# Altium schematic sheet PowerSup.SchDoc
size A3
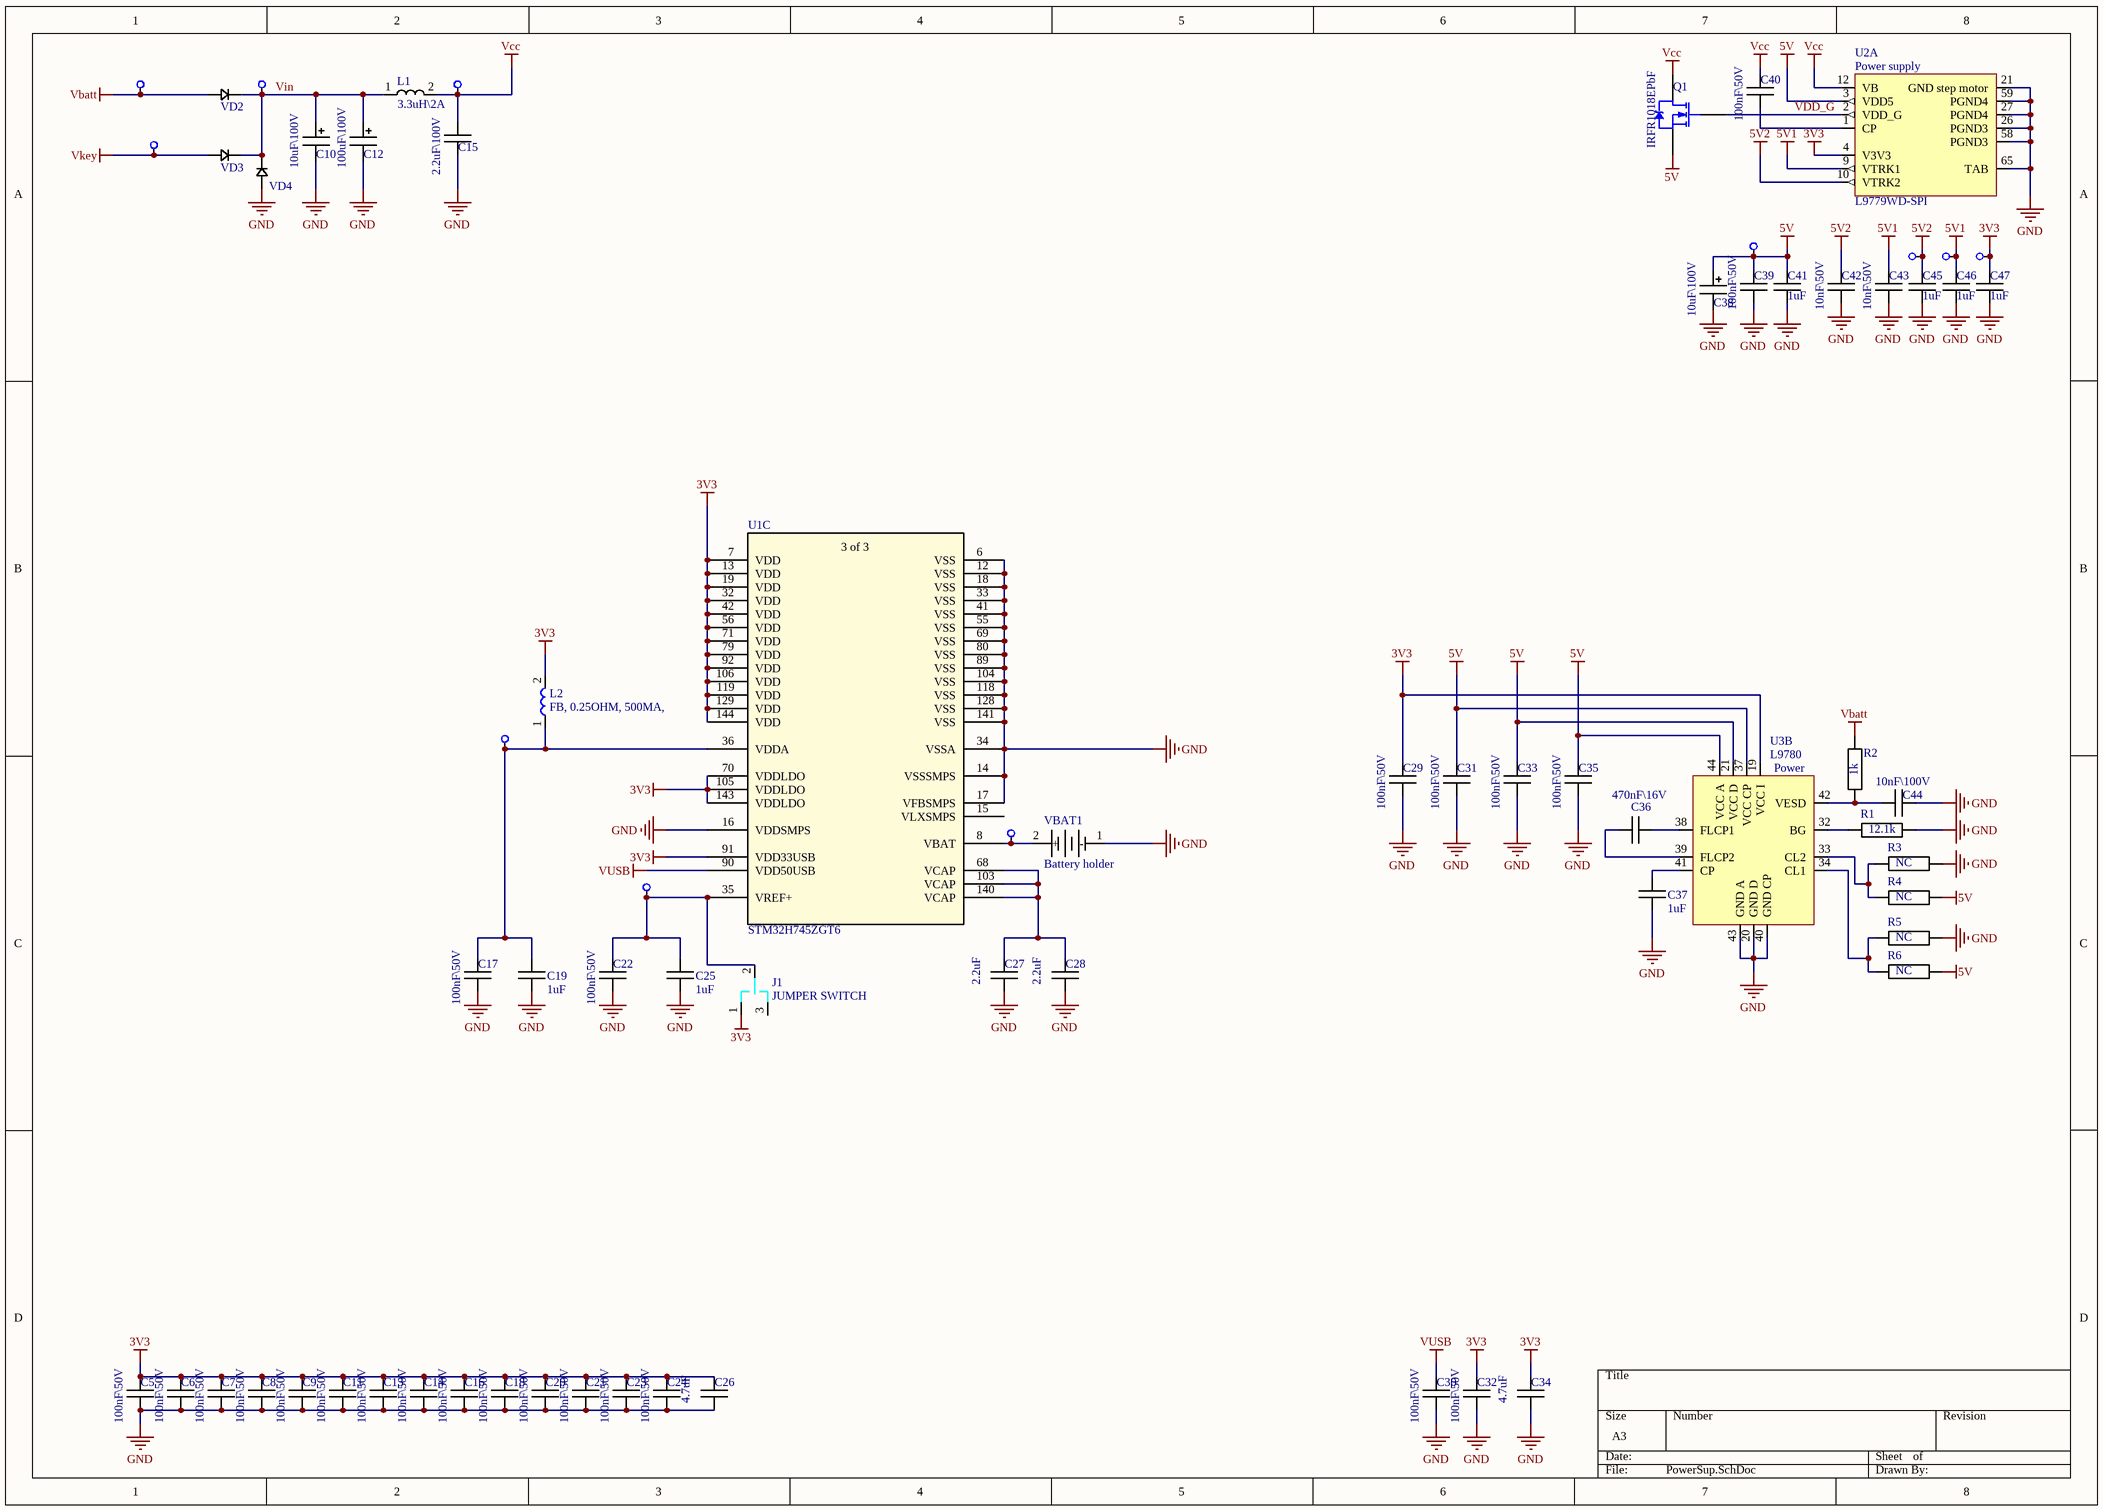
[diagram p0: PowerSup.SchDoc]

## Parts
C5  100nF\50V  [SMD 0603]
C6  100nF\50V  [SMD 0603]
C7  100nF\50V  [SMD 0603]
C8  100nF\50V  [SMD 0603]
C9  100nF\50V  [SMD 0603]
C10  10uF\100V  [CAP 5x11]
C11  100nF\50V  [SMD 0603]
C12  100uF\100V  [CAP 10x20]
C13  100nF\50V  [SMD 0603]
C14  100nF\50V  [SMD 0603]
C15  2.2uF\100V  [SMD 1206]
C16  100nF\50V  [SMD 0603]
C17  100nF\50V  [SMD 0603]
C18  100nF\50V  [SMD 0603]
C19  1uF  [SMD 0603]
C20  100nF\50V  [SMD 0603]
C21  100nF\50V  [SMD 0603]
C22  100nF\50V  [SMD 0603]
C23  100nF\50V  [SMD 0603]
C24  100nF\50V  [SMD 0603]
C25  1uF  [SMD 0603]
C26  4.7uF  [SMD 0603]
C27  2.2uF  [SMD 0603]
C28  2.2uF  [SMD 0603]
C29  100nF\50V  [SMD 0603]
C30  100nF\50V  [SMD 0603]
C31  100nF\50V  [SMD 0603]
C32  100nF\50V  [SMD 0603]
C33  100nF\50V  [SMD 0603]
C34  4.7uF  [SMD 0603]
C35  100nF\50V  [SMD 0603]
C36  470nF\16V  [SMD 0603]
C37  1uF  [SMD 0603]
C38  10uF\100V  [CAP 5x11]
C39  100nF\50V  [SMD 0603]
C40  100nF\50V  [SMD 0603]
C41  1uF  [SMD 0603]
C42  10nF\50V  [SMD 0603]
C43  10nF\50V  [SMD 0603]
C44  10nF\100V  [SMD 0603]
C45  1uF  [SMD 0603]
C46  1uF  [SMD 0603]
C47  1uF  [SMD 0603]
J1  JUMPER SWITCH  [JMP3]
L1  3.3uH\2A  [SDR0604]
L2  FB, 0.25OHM, 500MA,  [SMD 0805]
Q1  IRFR1018EPbF  [DPAK228P991X238-3M]
R1  12.1k  [SMD 0603]
R2  1k  [SMD 0603]
R3  NC  [SMD 0603]
R4  NC  [SMD 0603]
R5  NC  [SMD 0603]
R6  NC  [SMD 0603]
TP18  TestPoint  [TESTPOINT]  (value not drawn)
TP19  TestPoint  [TESTPOINT]  (value not drawn)
TP20  TestPoint  [TESTPOINT]  (value not drawn)
TP21  TestPoint  [TESTPOINT]  (value not drawn)
TP22  TestPoint  [TESTPOINT]  (value not drawn)
TP23  TestPoint  [TESTPOINT]  (value not drawn)
TP24  TestPoint  [TESTPOINT]  (value not drawn)
TP25  TestPoint  [TESTPOINT]  (value not drawn)
TP26  TestPoint  [TESTPOINT]  (value not drawn)
TP27  TestPoint  [TESTPOINT]  (value not drawn)
TP28  TestPoint  [TESTPOINT]  (value not drawn)
U1  STM32H745ZGT6  [LQFP-144]  (part C of 3)
U2  L9779WD-SPI  [HiQUAD-64]  (part A of 6)
U3  L9780  [LQFP-48N]  (part B of 4)
VBAT1  Battery holder  [796136-1]
VD2  Diode  [DO-214AA]  (value not drawn)
VD3  Diode  [DO-214AA]  (value not drawn)
VD4  Diode  [DO-214AB]  (value not drawn)

## Nets
3V3: C5.2 C6.2 C7.2 C8.2 C9.2 C11.2 C13.2 C14.2 C16.2 C18.2 C20.2 C21.2 C23.2 C24.2 C26.2 C29.2 C32.2 C34.2 C47.2 J1.1 L2.2 TP28.0 U1.7(VDD) U1.13(VDD) U1.19(VDD) U1.32(VDD) U1.42(VDD) U1.56(VDD) U1.70(VDDLDO) U1.71(VDD) U1.79(VDD) U1.91(VDD33USB) U1.92(VDD) U1.105(VDDLDO) U1.106(VDD) U1.119(VDD) U1.129(VDD) U1.143(VDDLDO) U1.144(VDD) U2.4(V3V3) U3.19(VCC_I)
5V: C31.2 C33.2 C35.2 C38.1 C39.2 C41.2 Q1.3(S) R4.2 R6.2 TP25.0 U2.3(VDD5) U3.21(VCC_D) U3.37(VCC_CP) U3.44(VCC_A)
5V1: C43.2 C46.2 TP27.0 U2.9(VTRK1)
5V2: C42.2 C45.2 TP26.0 U2.10(VTRK2)
GND: C5.1 C6.1 C7.1 C8.1 C9.1 C10.0 C11.1 C12.0 C13.1 C14.1 C15.1 C16.1 C17.1 C18.1 C19.2 C20.1 C21.1 C22.1 C23.1 C24.1 C25.2 C26.1 C27.1 C28.1 C29.1 C30.1 C31.1 C32.1 C33.1 C34.1 C35.1 C37.2 C38.0 C39.1 C41.1 C42.1 C43.1 C44.1 C45.1 C46.1 C47.1 R1.1 R3.1 R5.1 U1.6(VSS) U1.12(VSS) U1.14(VSSSMPS) U1.16(VDDSMPS) U1.17(VFBSMPS) U1.18(VSS) U1.33(VSS) U1.34(VSSA) U1.41(VSS) U1.55(VSS) U1.69(VSS) U1.80(VSS) U1.89(VSS) U1.104(VSS) U1.118(VSS) U1.128(VSS) U1.141(VSS) U2.21(GND_step_motor) U2.26(PGND3) U2.27(PGND4) U2.58(PGND3) U2.59(PGND4) U2.65(TAB) U3.20(GND_D) U3.40(GND_CP) U3.43(GND_A) VBAT1.1(-) VD4.0
Vbatt: R2.2 TP18.0 VD2.0
Vcc: C15.2 C40.2 L1.2 Q1.4(D) TP21.0 U2.12(VB)
Vkey: TP19.0 VD3.0
VUSB: C30.2 U1.90(VDD50USB)
VDD_G: Q1.1(G) U2.2(VDD_G)
Vin: C10.1 C12.1 L1.1 TP20.0 VD2.1 VD3.1 VD4.1
NetC17_2: C17.2 C19.1 L2.1 TP22.0 U1.36(VDDA)
NetC22_2: C22.2 C25.1 J1.2 TP23.0 U1.35(VREF+)
NetC27_2: C27.2 C28.2 U1.68(VCAP) U1.103(VCAP) U1.140(VCAP)
NetC36_1: C36.1 U3.38(FLCP1)
NetC36_2: C36.2 U3.39(FLCP2)
NetC37_1: C37.1 U3.41(CP)
NetC40_1: C40.1 U2.1(CP)
NetC44_2: C44.2 R2.1 U3.42(VESD)
NetR1_2: R1.2 U3.32(BG)
NetR3_2: R3.2 R4.1 U3.33(CL2)
NetR5_2: R5.2 R6.1 U3.34(CL1)
NetTP24_0: TP24.0 U1.8(VBAT) VBAT1.2(+)

Not connected (* = marked no-connect by the designer): J1 3; U1 15(VLXSMPS)

## Notes on the sheet
- (in symbol L9779WD-SPI, part A) Power supply
- (in symbol L9780, part B) Power
- (in symbol STM32H745ZGT6, part C) 3 of 3

## Library data of the parts
C5-C9 C11 C13 C14 C16-C18 C20-C24 C29-C33 C35 C39 C40 = Capasitor: CC0603KRX7R9BB104; Value: 100nF\50V
C10 C38 = Capasitor polar: SH100M0010BZF-0611; Value: 10uF\100V
C12 = Capasitor polar: SK100M0100B5S-1019; Value: 100uF\100V
C15 = Capasitor: GRM31CR72A225KA73L; Value: 2.2uF\100V
C19 C25 C37 C41 C45-C47 = Capasitor: CL10A105KB8NNNC; Value: 1uF
C26 C34 = Capasitor: CC0603KRX5R6BB475; Value: 4.7uF
C27 C28 = Capasitor: CC0603KRX5R6BB225; Value: 2.2uF
C36 = Capasitor: CC0603KRX7R7BB474; Value: 470nF\16V
C42 C43 = Capasitor: CC0603JRX7R9BB103; Value: 10nF\50V
C44 = Capasitor: CC0603KRX7R0BB103; Value: 10nF\100V
L1 = Inductor: SDR0604-3R3ML; Value: 3.3uH\2A
L2 = Inductor: BK2125HM601-T; Value: FB, 0.25OHM, 500MA,
Q1 = IRFR1018EPbF: HEXFET Power MOSFET; ComponentLink1Description: datasheet; ComponentLink1URL: https://data.electronshik.ru/z/Datasheet/I/IRFR1018EPBF.pdf
R1 = Resistor: RC0603FR-0712K1L; Value: 12.1k
R2 = Resistor: RC0603FR-071KL; Value: 1k
R3-R6 = Resistor: Value: NC
U1 = STM32H745ZGT6: No Description Available; Vendor: STMicroelectronics; Built_By: EMA_UL_Team; SourceLibrary: Updates_to_database_2020-10-19; Manufacturer_Part_Number: STM32H745ZGT6; Copyright: Copyright (C) 2018 Accelerated Designs. All rights reserved; RefDes: RefDes; Type: DEV
U2 = L9779WD-SPI: Multifunction IC for engine management system
U3 = L9780: Wide range air fuel sensor control interface
VBAT1 = Battery holder: Battery Holders, Battery Compatibility CR2032, Board-to-Board, 2 Position, Horizontal PCB Mount Orientation
VD2 = Diode: STTH4R02U
VD3 = Diode: STTH4R02U 200 V, 4 A High Effiency Ultrafast Diode; ComponentLink1Description: Datashit; ComponentLink1URL: https://www.st.com/resource/en/datasheet/stth4r02.pdf
VD4 = Diode: 5.0SMDJ30CA